# Altium schematic sheet ES.SchDoc
size A
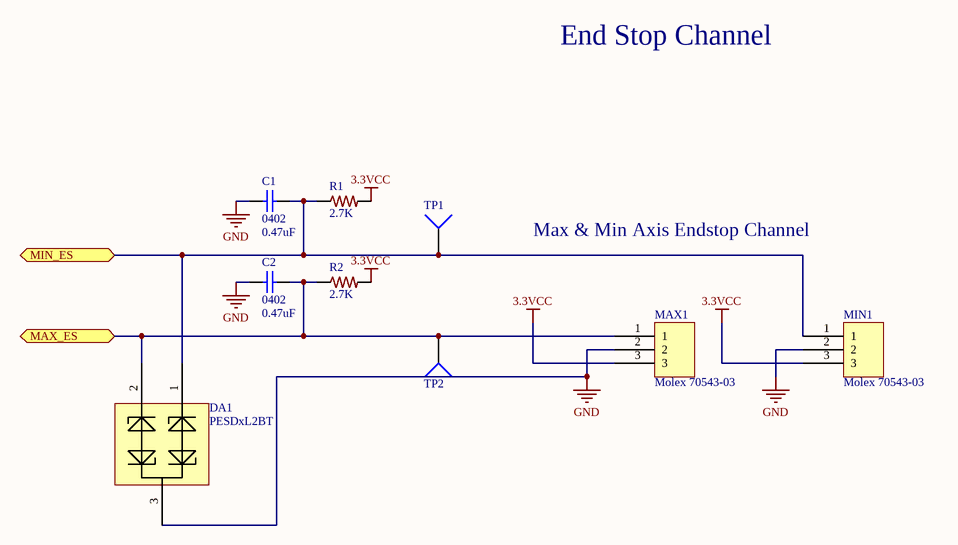
[diagram p0: ES.SchDoc]

## Parts
C1  value 0.47uF  [C0402]  (hidden comment: 0402)
C2  value 0.47uF  [C0402]  (hidden comment: 0402)
DA1  PESDxL2BT  [SOT95P230X110-3N]
MAX1  Molex 70543-03  [70543-03]
MIN1  Molex 70543-03  [70543-03]
R1  2.7K  [R0402]
R2  2.7K  [R0402]
TP1  TP4  [TP-2]  (value not drawn)
TP2  TP4  [TP-2]  (value not drawn)

## Ports
MAX_ES, MIN_ES

## Nets
3.3VCC: MAX1.3 MIN1.3 R1.2 R2.2
GND: C1.2 C2.2 DA1.3 MAX1.2 MIN1.2
MAX_ES: C2.1 DA1.2 MAX1.1 R2.1 TP2.1 ; port MAX_ES
MIN_ES: C1.1 DA1.1 MIN1.1 R1.1 TP1.1 ; port MIN_ES

## Notes on the sheet
- End Stop Channel
- Max & Min Axis Endstop Channel

## Library data of the parts
C1 C2 = GRM155R60J474KE19D: 0.47uF 6.3v C0402 - GRM155R60J474KE19D; MFR: Murata; Part Description: CAP CER 0.47UF 6.3V 10% X5R 0402; Tolerance: 10%; Voltage: 6.3VDC; Published: 10 - Dec - 2014; LatestRevisionDate: 10 - Dec - 2014; LatestRevisionNote: Ultimachine Footprint Added; Publisher: Ultimachine; Component Type: Chip Capacitor; MFR Part #: GRM155R60J474KE19D; Mounting Type: SMT 0402; Datasheet: http://search.murata.co.jp/Ceramy/image/img/A01X/G101/ENG/GRM155R60J474KE19-01.pdf; Height: 0.5 ±0.05mm; PackageReference: 0402
DA1 = PESDxL2BT: PESDxL2BT TVS Diode Array 2x
MAX1 MIN1 = Molex Endstop
R1 R2 = ERJ-2GEJ272X: RES SMD 2.7K OHM 5% 1/10W 0402; LastRevisionNote: ImportComponents; Published: 23-Apr-2014; Publisher: Adam Vadala-Roth; LastRevisionDate: 23-Apr-2014; ManufacturerPartNumber: ERJ-2GEJ272X; Digikey #: P2.7KJCT-ND; Tolerance: 5%; Mounting type: SMD; VALUE: 2.7K
TP1 TP2 = Socket: LatestRevisionDate: 17-Jul-2002; LatestRevisionNote: Re-released for DXP Platform.; Publisher: Altium Limited